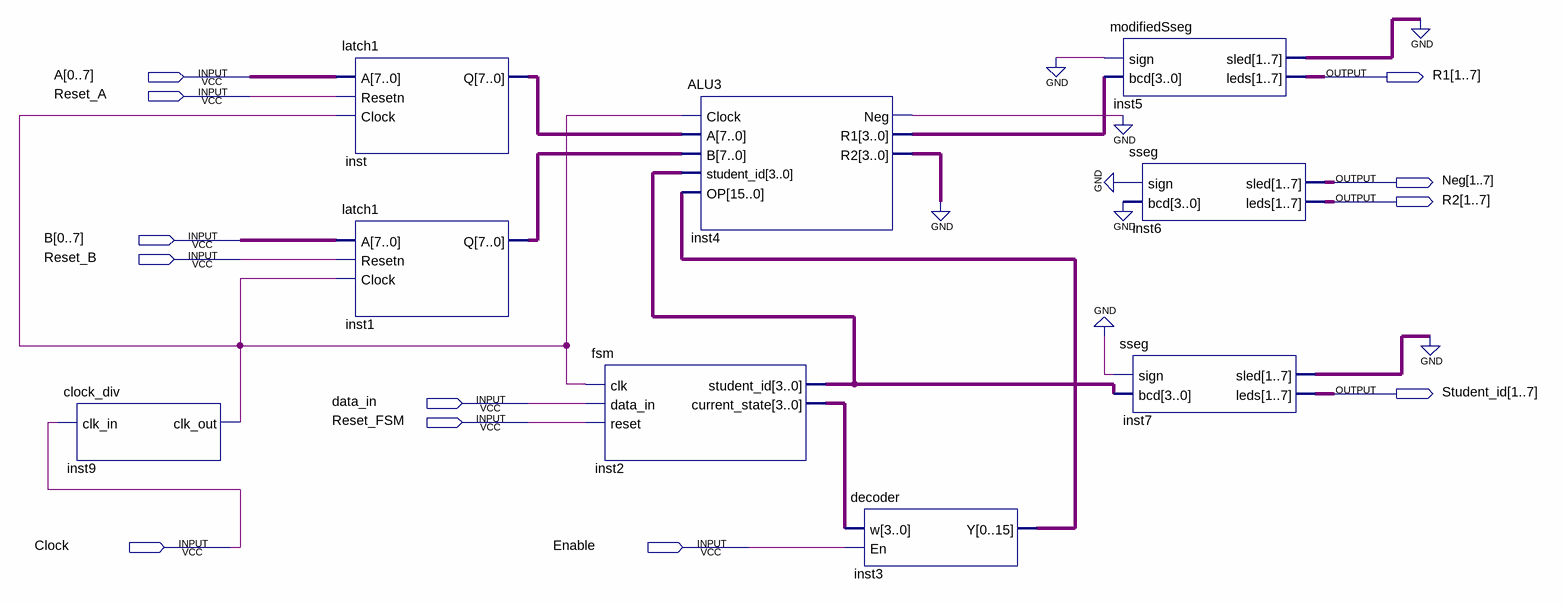
[diagram p0: schematic sheet]
// Quartus schematic Processor3.bdf as structural Verilog: 9 symbols, 12 pins
module Processor3 (
  input  [0:7] A,
  input  Reset_A,
  input  [0:7] B,
  input  Reset_B,
  input  data_in,
  input  Reset_FSM,
  input  Clock,
  input  Enable,
  output [1:7] R1,
  output [1:7] Neg,
  output [1:7] R2,
  output [1:7] Student_id
);

  wire inst4_neg, inst9_clk_out;
  wire [3:0] inst2_current_state, inst2_student_id, inst4_r1, inst4_r2;
  wire [6:0] inst5_sled, inst7_sled;
  wire [7:0] inst1_q, inst_q;
  wire [15:0] inst3_y;

  clock_div inst9 (.clk_in(Clock), .clk_out(inst9_clk_out));
  latch1 inst (.A(A), .Resetn(Reset_A), .Clock(inst9_clk_out), .Q(inst_q));
  latch1 inst1 (.A(B), .Resetn(Reset_B), .Clock(inst9_clk_out), .Q(inst1_q));
  fsm inst2 (
    .clk(inst9_clk_out), .data_in(data_in), .reset(Reset_FSM), .student_id(inst2_student_id),
    .current_state(inst2_current_state));
  ALU3 inst4 (
    .Clock(inst9_clk_out), .A(inst_q), .B(inst1_q), .student_id(inst2_student_id), .OP(inst3_y),
    .Neg(inst4_neg), .R1(inst4_r1), .R2(inst4_r2));
  decoder inst3 (.w(inst2_current_state), .En(Enable), .Y(inst3_y));
  modifiedSseg inst5 (.sign(1'b0), .bcd(inst4_r1), .sled(inst5_sled), .leds(R1));
  sseg inst6 (.sign(1'b0), .bcd(4'b0000), .sled(Neg), .leds(R2));
  sseg inst7 (.sign(1'b0), .bcd(inst2_student_id), .sled(inst7_sled), .leds(Student_id));
  // also tied to GND on the sheet: {inst4_r2[0], inst4_r2[1], inst4_r2[2], inst4_r2[3], inst5_sled[0], inst5_sled[1], inst5_sled[2], inst5_sled[3], inst5_sled[4], inst5_sled[5], inst5_sled[6], inst7_sled[0], inst7_sled[1], inst7_sled[2], inst7_sled[3], inst7_sled[4], inst7_sled[5], inst7_sled[6], inst4_neg}
endmodule
